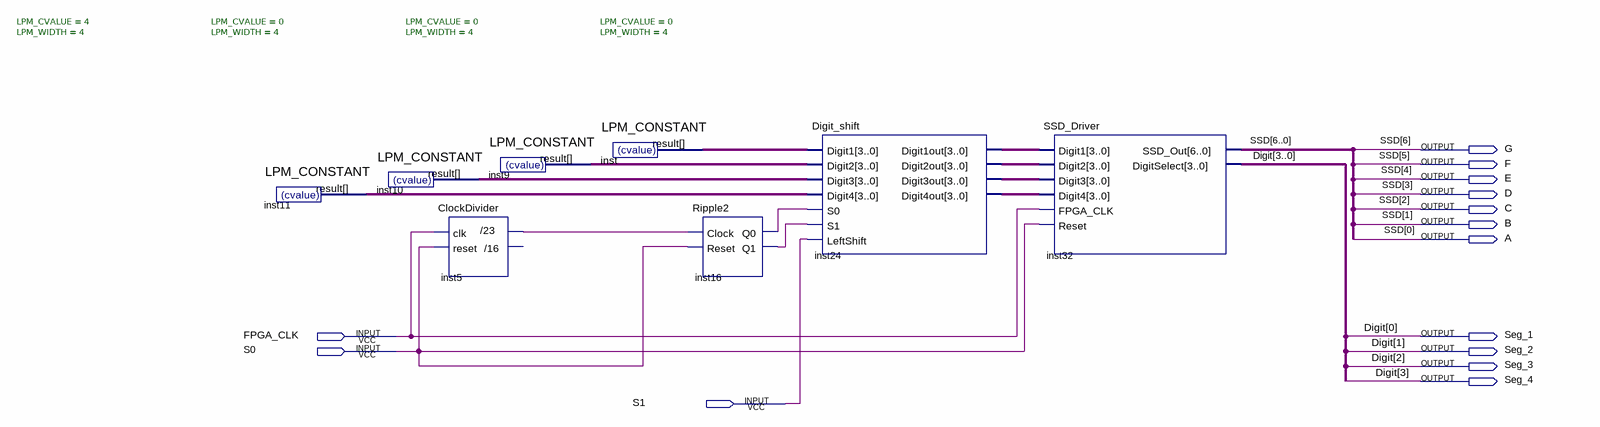
[diagram p0: schematic sheet]
// Quartus schematic Lab4.bdf as structural Verilog: 8 symbols, 14 pins
module Lab4 (
  input  FPGA_CLK,
  input  S0,
  input  S1,
  output G,
  output F,
  output E,
  output D,
  output C,
  output B,
  output A,
  output Seg_1,
  output Seg_2,
  output Seg_3,
  output Seg_4
);

  wire inst5__23, inst16_q0, inst16_q1;
  wire [3:0] inst9_result, inst10_result, inst11_result, inst24_digit1out, inst24_digit2out,
       inst24_digit3out, inst24_digit4out, inst_result;

  LPM_CONSTANT #(.LPM_CVALUE(4), .LPM_WIDTH(4)) inst11 (.result(inst11_result));
  LPM_CONSTANT #(.LPM_CVALUE(0), .LPM_WIDTH(4)) inst10 (.result(inst10_result));
  ClockDivider inst5 (.clk(FPGA_CLK), .reset(S0), .\/23 (inst5__23));  // open: /16
  LPM_CONSTANT #(.LPM_CVALUE(0), .LPM_WIDTH(4)) inst9 (.result(inst9_result));
  LPM_CONSTANT #(.LPM_CVALUE(0), .LPM_WIDTH(4)) inst (.result(inst_result));
  Ripple2 inst16 (.Clock(inst5__23), .Reset(S0), .Q0(inst16_q0), .Q1(inst16_q1));
  Digit_shift inst24 (
    .Digit1(inst_result), .Digit2(inst9_result), .Digit3(inst10_result), .Digit4(inst11_result),
    .S0(inst16_q0), .S1(inst16_q1), .LeftShift(S1), .Digit1out(inst24_digit1out),
    .Digit2out(inst24_digit2out), .Digit3out(inst24_digit3out), .Digit4out(inst24_digit4out));
  SSD_Driver inst32 (
    .Digit1(inst24_digit1out), .Digit2(inst24_digit2out), .Digit3(inst24_digit3out),
    .Digit4(inst24_digit4out), .FPGA_CLK(FPGA_CLK), .Reset(S0), .SSD_Out({G, F, E, D, C, B, A}),
    .DigitSelect({Seg_4, Seg_3, Seg_2, Seg_1}));

  // Other names for the same wires on the sheet: Digit[3:0] = {Seg_4, Seg_3, Seg_2, Seg_1};
  //   SSD[6:0] = {G, F, E, D, C, B, A}
endmodule
